# Altium schematic sheet Micro_Card.SchDoc: Micro Card - MUEEC Membership Card
size A3
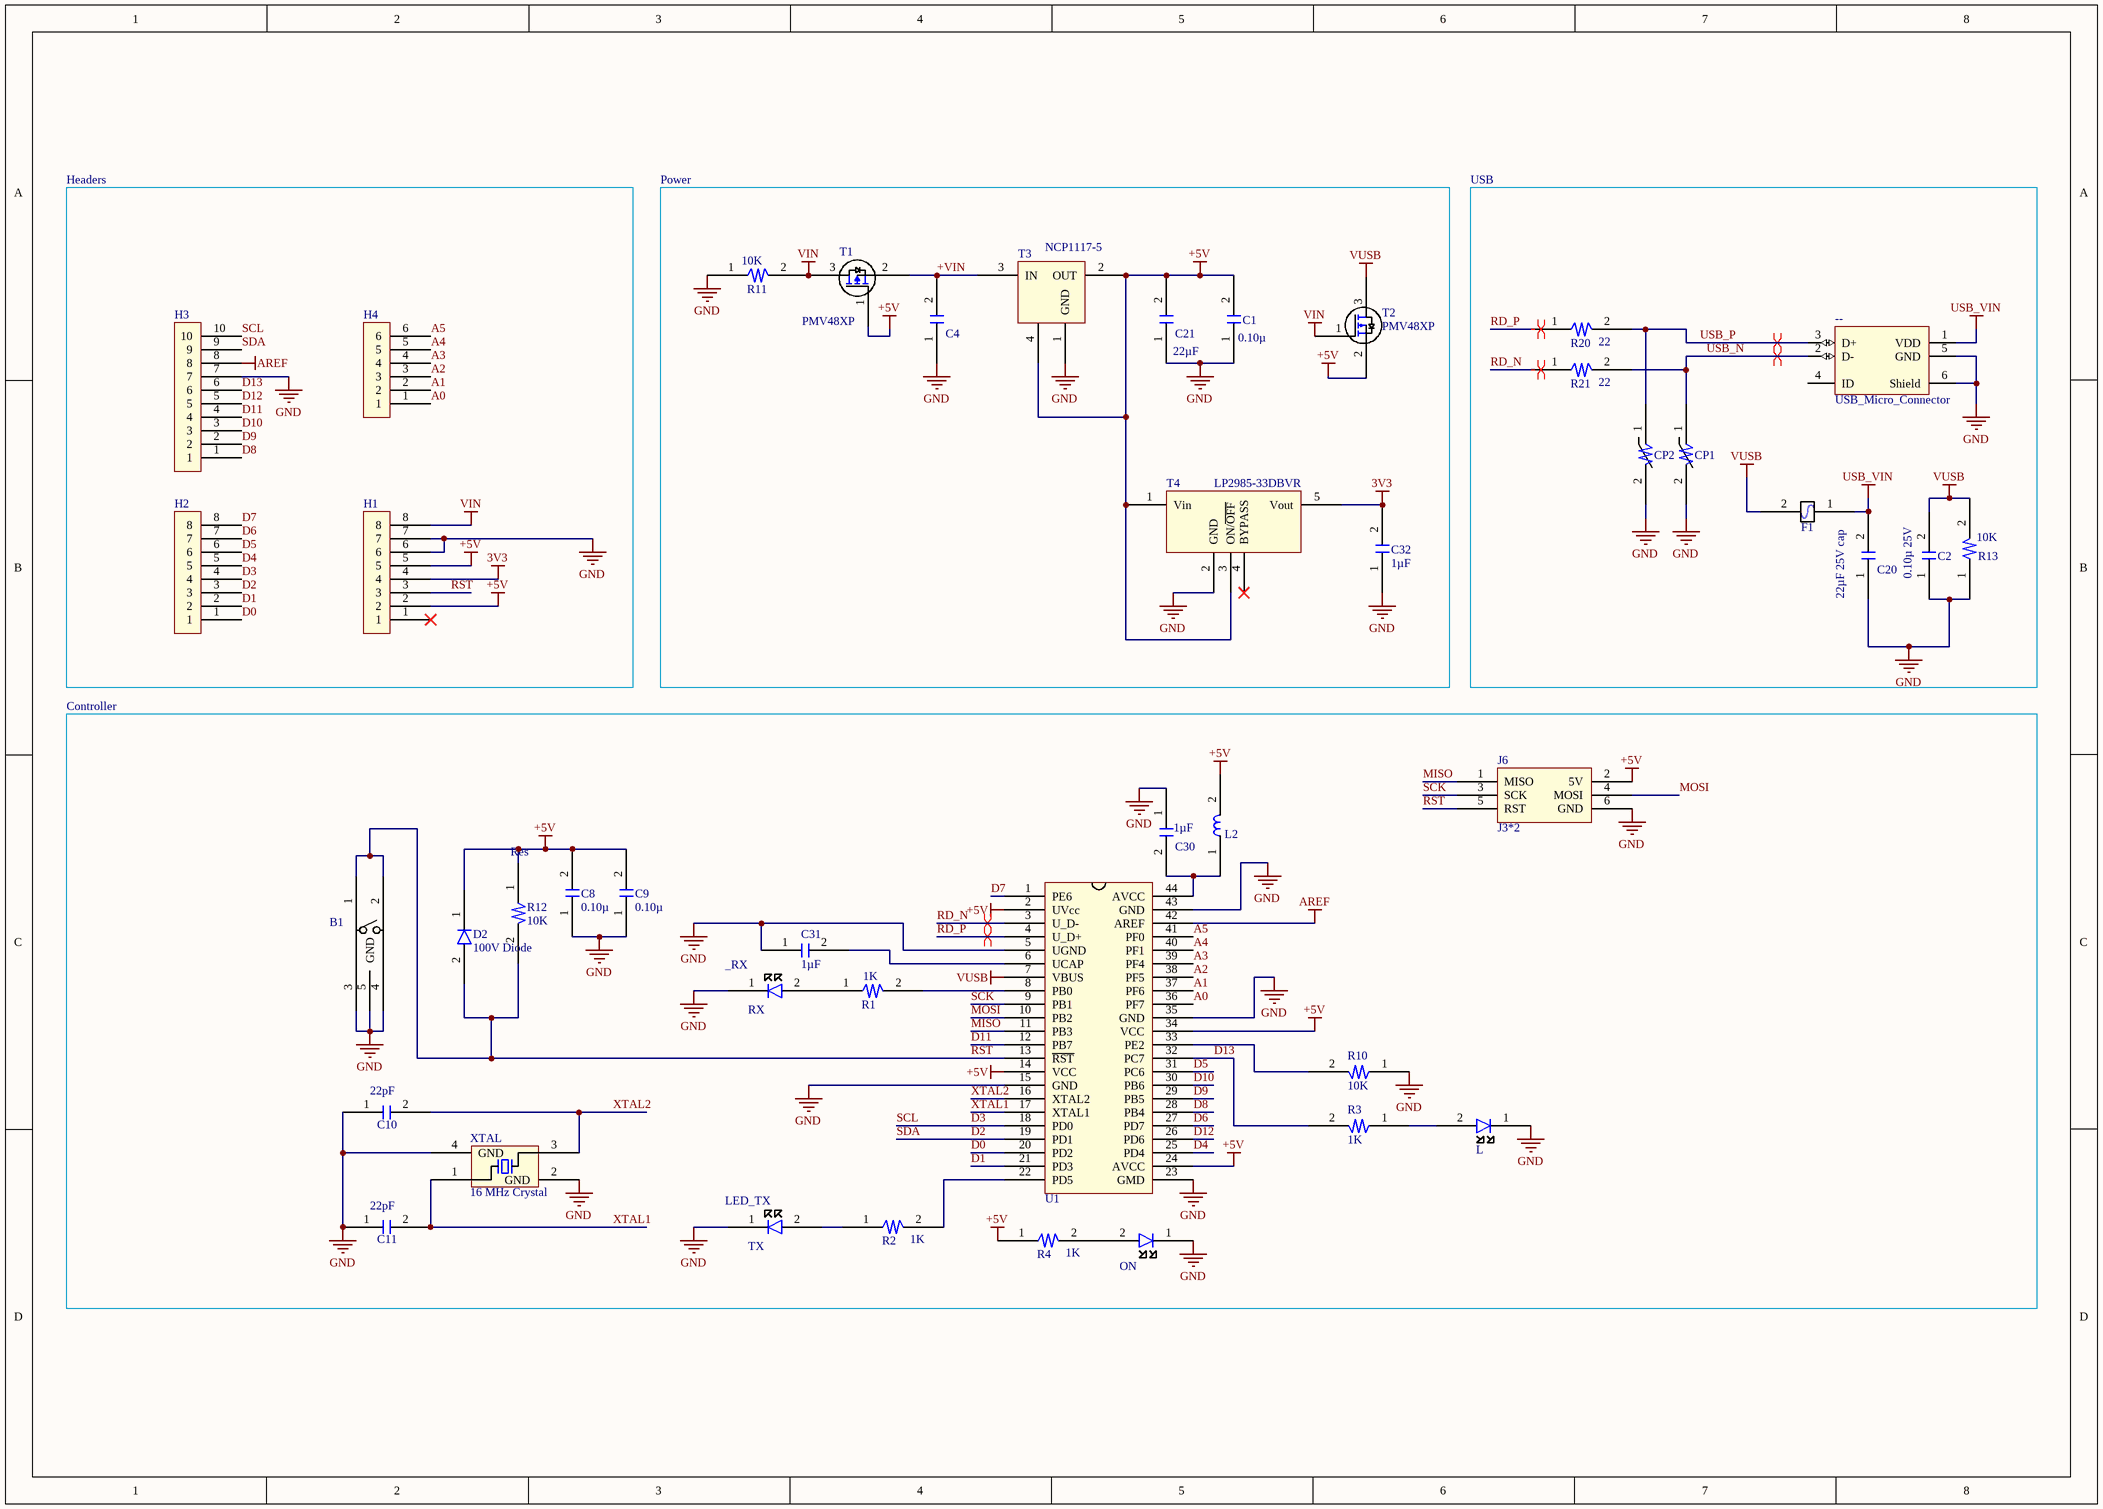
[diagram p0: Micro_Card.SchDoc]

## Parts
--  USB_Micro_Connector  [USB_micro_through]
B1  off-mom  [450-1760]  (value not drawn)
C1  0.10µ  [R15_0805_cap_M]
C2  0.10µ 25V  [R15_0805_cap_M]
C4  0.10µF ±10% 25V Ceramic Capacitor X7R 0805 (2012 Metric)  [R15_0805_cap_M]  (value not drawn)
C8  0.10µ  [R15_0805_cap_M]
C9  0.10µ  [R15_0805_cap_M]
C10  22pF  [R15_0805_cap_M]
C11  22pF  [R15_0805_cap_M]
C20  22µF 25V cap  [X5R_22uF_25v_1206_X_M]
C21  22µF  [X5R_22uF_25v_1206_X_M]
C30  1µF  [C2012_M]
C31  1µF  [C2012_M]
C32  1µF  [C2012_M]
CP1  Gard Resistor  [UltraGuard 0805]  (value not drawn)
CP2  Gard Resistor  [UltraGuard 0805]  (value not drawn)
D2  100V Diode  [CD1206-S01575]
F1  MF-MSF0502  [MF-MSMF050_M]  (value not drawn)
H1  H8  [H8]  (value not drawn)
H2  H8  [H8]  (value not drawn)
H3  H10  [H10]  (value not drawn)
H4  H6  [H6]  (value not drawn)
J6  J3*2  [J3*2]
L  LED_L  [Wurth led 0805]  (value not drawn)
L2  MH2029 - 300Y  [MH2029-300YC]  (value not drawn)
ON  LED_ON  [Wurth led 0805]  (value not drawn)
R1  value 1K  [RNCP0805_M]  (hidden comment: Res)
R2  value 1K  [RNCP0805_M]  (hidden comment: Res)
R3  value 1K  [RNCP0805_M]  (hidden comment: Res)
R4  1K  [RNCP0805_M]
R10  10K  [RNCP0805_M]
R11  value 10K  [RNCP0805_M]  (hidden comment: Res)
R12  Res  value 10K  [RNCP0805_M]
R13  10K  [RNCP0805_M]
R20  22  [RNCP0805_M]
R21  22  [RNCP0805_M]
RX  _RX  [Wurth led 0805]
T1  PMV48XP  [PMV48XP_SOT23]
T2  PMV48XP  [PMV48XP_SOT23]
T3  NCP1117-5  [NCP1117_SOT223]
T4  LP2985-33DBVR  [LP2985_SOT23_M]
TX  LED_TX  [Wurth led 0805]
U1  ATmega32U4  [ATmega32u4_TQFP44]  (value not drawn)
XTAL  16 MHz Crystal  [TSX-3225]

## Blocks framed on the sheet
Headers: H1-H4
Power: C1 C4 C21 C32 R11 T1-T4
USB: -- C2 C20 CP1 CP2 F1 R13 R20 R21
Controller: B1 C8-C11 C30 C31 D2 J6 L L2 ON R1-R4 R10 R12 RX TX U1 XTAL

## Nets
3V3: C32.2 H1.4 T4.5(Vout)
+5V: C1.2 C8.2 C9.2 C21.2 D2.1 H1.2 H1.5 J6.2(5V) L2.2 R4.1 R12.1 T1.1(G) T2.2(S) T3.2(OUT) T3.4(tab) T4.1(Vin) T4.3(ON/~{OFF}) U1.2(UVcc) U1.14(VCC) U1.24(AVCC) U1.34(VCC)
AREF: H3.8 U1.42(AREF)
GND: --.5(GND) --.6(Shield) B1.3 B1.4 B1.5(GND) C1.1 C2.1 C4.1 C8.1 C9.1 C10.1 C11.1 C20.1 C21.1 C30.1 C31.1 C32.1 CP1.2 CP2.2 H1.6 H1.7 H3.7 J6.6(GND) L.1 ON.1 R10.1 R11.1 R13.1 RX.1 T3.1(GND) T4.2(GND) TX.1 U1.5(UGND) U1.15(GND) U1.23(GMD) U1.35(GND) U1.43(GND) XTAL.2(GND) XTAL.4(GND)
USB_VIN: --.1(VDD) C20.2 F1.1
VIN: H1.8 R11.2 T1.3(D) T2.1(G)
VUSB: C2.2 F1.2 R13.2 T2.3(D) U1.7(VBUS)
+VIN: C4.2 T1.2(S) T3.3(IN)
A0: H4.1 U1.36(PF7)
A1: H4.2 U1.37(PF6)
A2: H4.3 U1.38(PF5)
A3: H4.4 U1.39(PF4)
A4: H4.5 U1.40(PF1)
A5: H4.6 U1.41(PF0)
D0: H2.1 U1.20(PD2)
D1: H2.2 U1.21(PD3)
D2: H2.3 H3.9 U1.19(PD1)  [also labelled SDA]
D3: H2.4 H3.10 U1.18(PD0)  [also labelled SCL]
D4: H2.5 U1.25(PD4)
D5: H2.6 U1.31(PC6)
D6: H2.7 U1.27(PD7)
D7: H2.8 U1.1(PE6)
D8: H3.1 U1.28(PB4)
D9: H3.2 U1.29(PB5)
D10: H3.3 U1.30(PB6)
D11: H3.4 U1.12(PB7)
D12: H3.5 U1.26(PD6)
D13: H3.6 R3.2 U1.32(PC7)
MISO: J6.1(MISO) U1.11(PB3)
MOSI: J6.4(MOSI) U1.10(PB2)
RD_N: R21.1 U1.3(U_D-)
RD_P: R20.1 U1.4(U_D+)
RST: B1.1 B1.2 D2.2 H1.3 J6.5(RST) R12.2 U1.13(~{RST})
SCK: J6.3(SCK) U1.9(PB1)
USB_N: --.2(D-) CP1.1 R21.2
USB_P: --.3(D+) CP2.1 R20.2
XTAL1: C11.2 U1.17(XTAL1) XTAL.1
XTAL2: C10.2 U1.16(XTAL2) XTAL.3
NetC30_2: C30.2 L2.1 U1.44(AVCC)
NetC31_2: C31.2 U1.6(UCAP)
NetL_2: L.2 R3.1
NetON_2: ON.2 R4.2
NetR1_1: R1.1 RX.2
NetR1_2: R1.2 U1.8(PB0)
NetR2_1: R2.1 TX.2
NetR2_2: R2.2 U1.22(PD5)
NetR10_2: R10.2 U1.33(PE2)

Not connected (* = marked no-connect by the designer): -- 4(ID); H1 1*; T4 4(BYPASS)*

## Layout directives
differential pair: RD_N, RD_P, USB_N, USB_P

## Library data of the parts
-- = USB_micro_through: CONN USB MICRO B RECPT SMT R/A; Manufacturer Part Number: 10118194-0001LF; 01 Created By: David Lynch @ 30/11/2017; 02 Reviewed By: Rodrigo Maureira @ 14/01/2018; Supplier Part Number 1: 609-4618-1-ND; Digikey URL: https://www.digikey.com.au/product-detail/en/amphenol-fci/10118194-0001LF/609-4618-1-ND/2785382; Supplier 1: Digi-Key
B1 = Button: Tactile Button; Value: NA; Details: Button; Supplier 1: Digi-Key; Type: off-mom; Name: Tactile Button; Supplier Part Number 1: 450-1760-1-ND; Mounting Type: SMD
C1 C8 C9 = 0.10µF 25V Cap: Cap.; Details: 0.10µF; Value: 0.10µF; Type: Ceramic Capacitor; Footprint: 0805 (2012 Metric) -X7R; Supplier 1: Digi-Key; Name: Cap.; Supplier Part Number 1: 709-1185-1-ND; Mounting Type: SMD
C2 = 0.10µF 25V Cap: Cap.; Details: 0.10µF; Value: 0.10µF; Type: Ceramic Capacitor; Voltage Rating: 100; Footprint: 0805 (2012 Metric) -X7R; Supplier 1: Digi-Key; Name: Cap.; Supplier Part Number 1: 709-1185-1-ND; Mounting Type: SMD
C4 = 0.10µF ±10% 25V cap: Cap.; Supplier 1: Digi-Key; Supplier Part Number 1: 709-1185-1-ND; Details: 0.10µF; Name: Cap.; Type: Ceramic Capacitor; Value: 0.10µF; Mounting Type: SMD
C10 C11 = 22pF 50V cap: Cap.; Type: Ceramic Capacitor; Details: 22pF; Supplier 1: Digi-Key; Name: Cap.; Supplier Part Number 1: 709-1172-1-ND; Value: 22pF; Mounting Type: SMD
C20 C21 = 22µF 25V cap: Cap.; Details: 22uF; Type: Ceramic Capacitor; Value: 22uF; Supplier 1: Digi-Key; Name: Cap.; Supplier Part Number 1: 490-12451-1-ND; Mounting Type: SMD
C30-C32 = 1µF 50V cap: Cap.; Details: 1uF; Type: Ceramic Capacitor; Value: 1uF; Supplier 1: Digi-Key; Name: Cap.; Supplier Part Number 1: 1276-3098-1-ND; Mounting Type: SMD
CP1 CP2 = Gard Resistor: Value: NA; Supplier 1: Digi-Key; Name: Gard Resistor; Supplier Part Number 1: 478-5584-1-ND; Mounting Type: SMD
D2 = CD1206 - S01575: Standard Diode; Value: NA; Voltage Rating: 100; Supplier 1: Digi-Key; Name: Standard Diode; Supplier Part Number 1: CD1206-S01575CT-ND; Mounting Type: SMD
F1 = MF-MSF0502: Resetable fuse; Value: NA; Supplier 1: Digi-Key; Name: Resetable fuse; Supplier Part Number 1: MF-MSMF050-2CT-ND; Mounting Type: SMD
H1 H2 = H8: Header; Value: NA; Supplier 1: Digi-Key; Name: Header; Supplier Part Number 1: S7006-ND; Mounting Type: SMD
H3 = H10: Header; Value: NA; Supplier 1: Digi-Key; Name: Header; Supplier Part Number 1: S7043-ND; Mounting Type: SMD
H4 = H6: Header; Value: NA; Supplier 1: Digi-Key; Name: Header; Supplier Part Number 1: S7039-ND; Mounting Type: SMD
J6 = J3*2: Header; Value: NA; Supplier 1: Digi-Key; Name: Header; Supplier Part Number 1: S7039-ND; Mounting Type: SMD
L ON = LED: LED clear; Value: NA; Voltage Rating: BLUE clear; Supplier 1: Digi-Key; Name: LED clear; Supplier Part Number 1: 732-4982-1-ND; Mounting Type: SMD
L2 = MH2029 - 300Y: Ferite Bead; Value: NA; Name: Ferite Bead; Supplier 1: Digi-Key; Supplier Part Number 1: MH2029-300YCT-ND; Mounting Type: SMD
R1-R4 R10-R13 R20 R21 = Res: Res.; Supplier 1: Digi-Key; Name: Res.; Mounting Type: SMD
  R1-R3: Details: 1K; Supplier Part Number 1: RNCP0805FTD1K00CT-ND
  R4: Value: 1K; Details: 1K; Supplier Part Number 1: RNCP0805FTD1K00CT-ND
  R10 R13: Value: 10K; Details: 10K; Supplier Part Number 1: RNCP0805FTD10K0CT-ND
  R11 R12: Details: 10K; Supplier Part Number 1: RNCP0805FTD10K0CT-ND
  R20 R21: Value: 22; Details: 22; Supplier Part Number 1: RMCF0805FT22R0CT-ND
RX = LED: LED clear; Voltage Rating: GREEN clear; Supplier 1: Digi-Key; Name: LED clear; Supplier Part Number 1: 732-4983-1-ND; Mounting Type: SMD
T1 T2 = PMV48XP: P type MOSFET; Supplier 1: Digi-Key; Name: P type MOSFET; Supplier Part Number 1: 1727-5907-1-ND; Mounting Type: SMD
T3 = NCP1117-5: 5V reg; Supplier 1: Digi-Key; Name: 5V reg; Supplier Part Number 1: NCP1117ST50T3GOSCT-ND; Mounting Type: SMD
T4 = LP2985-33DBVR: 3.3V reg; Supplier 1: Digi-Key; Name: 3.3V reg; Supplier Part Number 1: 296-18476-1-ND; Mounting Type: SMD
TX = LED: LED clear; Voltage Rating: YELLOW clear; Supplier 1: Digi-Key; Name: LED clear; Supplier Part Number 1: 732-4987-1-ND; Mounting Type: SMD
XTAL = 16 MHz Crystal: Crystal; Supplier 1: Digi-Key; Name: Crystal; Supplier Part Number 1: SER4069CT-ND; Mounting Type: SMD
U1 = ATmega32U4: Supplier 1: Digi-Key; Name: ATmega32U4; Supplier Part Number 1: ATMEGA32U4-AU-ND; Mounting Type: SMD